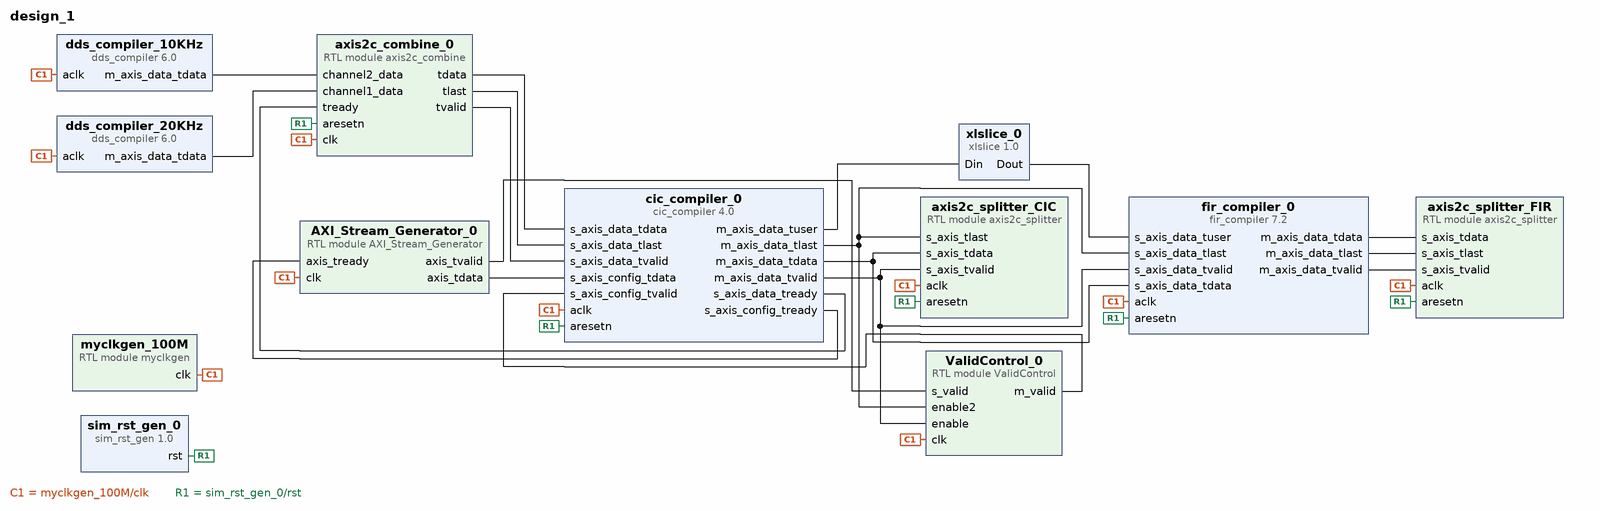
[diagram p0: block diagram of the top level]
# Vivado block design design_1, xc7z010iclg400-1L, Vivado 2022.2
create_bd_design design_1

create_bd_cell -type ip -vlnv xilinx.com:ip:dds_compiler:6.0 dds_compiler_20KHz
set_property -dict [list \
  CONFIG.Has_Phase_Out false \
  CONFIG.Latency 8 \
  CONFIG.M_DATA_Has_TUSER Not_Required \
  CONFIG.Noise_Shaping Auto \
  CONFIG.Output_Selection Sine \
  CONFIG.Output_Width 16 \
  CONFIG.Phase_Width 28 \
  CONFIG.Spurious_Free_Dynamic_Range 95 \
] [get_bd_cells dds_compiler_20KHz]
create_bd_cell -type module -reference myclkgen myclkgen_100M
create_bd_cell -type ip -vlnv xilinx.com:ip:cic_compiler:4.0 cic_compiler_0
set_property -dict [list \
  CONFIG.Clock_Frequency 100 \
  CONFIG.Filter_Type Decimation \
  CONFIG.HAS_ARESETN true \
  CONFIG.Input_Data_Width 16 \
  CONFIG.Input_Sample_Frequency 50 \
  CONFIG.Maximum_Rate 1024 \
  CONFIG.Minimum_Rate 4 \
  CONFIG.Number_Of_Channels 2 \
  CONFIG.Output_Data_Width 16 \
  CONFIG.Quantization Truncation \
  CONFIG.SamplePeriod 1 \
  CONFIG.Sample_Rate_Changes Programmable \
] [get_bd_cells cic_compiler_0]
create_bd_cell -type module -reference axis2c_combine axis2c_combine_0
create_bd_cell -type ip -vlnv xilinx.com:ip:sim_rst_gen:1.0 sim_rst_gen_0
create_bd_cell -type ip -vlnv xilinx.com:ip:dds_compiler:6.0 dds_compiler_10KHz
set_property -dict [list \
  CONFIG.Has_Phase_Out false \
  CONFIG.Latency 8 \
  CONFIG.M_DATA_Has_TUSER Not_Required \
  CONFIG.Noise_Shaping Auto \
  CONFIG.Output_Frequency1 0.01 \
  CONFIG.Output_Selection Sine \
  CONFIG.Output_Width 16 \
  CONFIG.PINC1 110100011011011 \
  CONFIG.Phase_Width 28 \
  CONFIG.Spurious_Free_Dynamic_Range 95 \
] [get_bd_cells dds_compiler_10KHz]
create_bd_cell -type module -reference AXI_Stream_Generator AXI_Stream_Generator_0
set_property -dict [list \
  CONFIG.DATA_0 0x00000004 \
  CONFIG.DATA_1 0x00000008 \
  CONFIG.TIMEOUT_0 44737 \
  CONFIG.TIMEOUT_1 44927 \
  CONFIG.TIMEOUT_2 0 \
  CONFIG.TIMEOUT_3 0 \
] [get_bd_cells AXI_Stream_Generator_0]
create_bd_cell -type module -reference axis2c_splitter axis2c_splitter_CIC
create_bd_cell -type ip -vlnv xilinx.com:ip:fir_compiler:7.2 fir_compiler_0
set_property -dict [list \
  CONFIG.Clock_Frequency 100 \
  CONFIG.Coefficient_Structure Inferred \
  CONFIG.Coefficient_Width 16 \
  CONFIG.ColumnConfig 11 \
  CONFIG.DATA_Has_TLAST Vector_Framing \
  CONFIG.Filter_Architecture Systolic_Multiply_Accumulate \
  CONFIG.Has_ARESETn true \
  CONFIG.M_DATA_Has_TUSER Not_Required \
  CONFIG.Number_Channels 2 \
  CONFIG.Output_Rounding_Mode Truncate_LSBs \
  CONFIG.Output_Width 16 \
  CONFIG.S_DATA_Has_TUSER Chan_ID_Field \
  CONFIG.Sample_Frequency 50 \
  CONFIG.Select_Pattern All \
] [get_bd_cells fir_compiler_0]
create_bd_cell -type ip -vlnv xilinx.com:ip:xlslice:1.0 xlslice_0
set_property -dict {CONFIG.DIN_WIDTH 16} [get_bd_cells xlslice_0]
create_bd_cell -type module -reference axis2c_splitter axis2c_splitter_FIR
create_bd_cell -type module -reference ValidControl ValidControl_0

# ---- connections ----

connect_bd_net [get_bd_pins AXI_Stream_Generator_0/axis_tdata] [get_bd_pins cic_compiler_0/s_axis_config_tdata]
connect_bd_net [get_bd_pins AXI_Stream_Generator_0/axis_tvalid] [get_bd_pins ValidControl_0/s_valid]
connect_bd_net [get_bd_pins ValidControl_0/m_valid] [get_bd_pins cic_compiler_0/s_axis_config_tvalid]
connect_bd_net [get_bd_pins axis2c_combine_0/tdata] [get_bd_pins cic_compiler_0/s_axis_data_tdata]
connect_bd_net [get_bd_pins axis2c_combine_0/tlast] [get_bd_pins cic_compiler_0/s_axis_data_tlast]
connect_bd_net [get_bd_pins axis2c_combine_0/tvalid] [get_bd_pins cic_compiler_0/s_axis_data_tvalid]
connect_bd_net [get_bd_pins cic_compiler_0/m_axis_data_tdata] \
  [get_bd_pins axis2c_splitter_CIC/s_axis_tdata] [get_bd_pins fir_compiler_0/s_axis_data_tdata]
connect_bd_net [get_bd_pins cic_compiler_0/m_axis_data_tlast] \
  [get_bd_pins axis2c_splitter_CIC/s_axis_tlast] [get_bd_pins fir_compiler_0/s_axis_data_tlast] \
  [get_bd_pins ValidControl_0/enable2]
connect_bd_net [get_bd_pins cic_compiler_0/m_axis_data_tuser] [get_bd_pins xlslice_0/Din]
connect_bd_net [get_bd_pins cic_compiler_0/m_axis_data_tvalid] \
  [get_bd_pins axis2c_splitter_CIC/s_axis_tvalid] [get_bd_pins fir_compiler_0/s_axis_data_tvalid] \
  [get_bd_pins ValidControl_0/enable]
connect_bd_net [get_bd_pins cic_compiler_0/s_axis_config_tready] [get_bd_pins AXI_Stream_Generator_0/axis_tready]
connect_bd_net [get_bd_pins cic_compiler_0/s_axis_data_tready] [get_bd_pins axis2c_combine_0/tready]
connect_bd_net [get_bd_pins dds_compiler_10KHz/m_axis_data_tdata] [get_bd_pins axis2c_combine_0/channel2_data]
connect_bd_net [get_bd_pins dds_compiler_20KHz/m_axis_data_tdata] [get_bd_pins axis2c_combine_0/channel1_data]
connect_bd_net [get_bd_pins fir_compiler_0/m_axis_data_tdata] [get_bd_pins axis2c_splitter_FIR/s_axis_tdata]
connect_bd_net [get_bd_pins fir_compiler_0/m_axis_data_tlast] [get_bd_pins axis2c_splitter_FIR/s_axis_tlast]
connect_bd_net [get_bd_pins fir_compiler_0/m_axis_data_tvalid] [get_bd_pins axis2c_splitter_FIR/s_axis_tvalid]
connect_bd_net -net myclkgen_0_clk [get_bd_pins myclkgen_100M/clk] \
  [get_bd_pins dds_compiler_20KHz/aclk] [get_bd_pins cic_compiler_0/aclk] [get_bd_pins axis2c_combine_0/clk] \
  [get_bd_pins dds_compiler_10KHz/aclk] [get_bd_pins AXI_Stream_Generator_0/clk] [get_bd_pins axis2c_splitter_CIC/aclk] \
  [get_bd_pins fir_compiler_0/aclk] [get_bd_pins axis2c_splitter_FIR/aclk] [get_bd_pins ValidControl_0/clk]
connect_bd_net [get_bd_pins sim_rst_gen_0/rst] \
  [get_bd_pins axis2c_combine_0/aresetn] [get_bd_pins cic_compiler_0/aresetn] [get_bd_pins axis2c_splitter_CIC/aresetn] \
  [get_bd_pins fir_compiler_0/aresetn] [get_bd_pins axis2c_splitter_FIR/aresetn]
connect_bd_net [get_bd_pins xlslice_0/Dout] [get_bd_pins fir_compiler_0/s_axis_data_tuser]

validate_bd_design
save_bd_design
